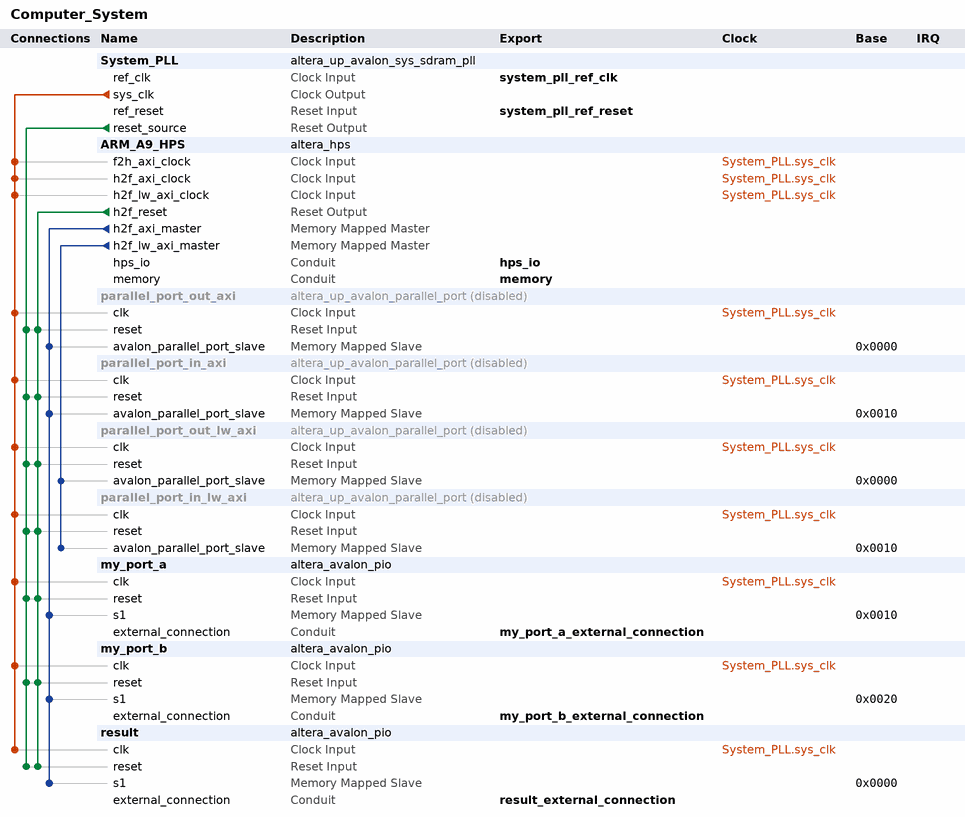
[diagram p0: system contents]
# Platform Designer (Qsys) system Computer_System, Cyclone V 5CSEMA5F31C6
# Parameters at their usual value, and those the tool derives, are not listed.
package require -exact qsys 18.0
create_system Computer_System
set_project_property DEVICE_FAMILY {Cyclone V}
set_project_property DEVICE 5CSEMA5F31C6

add_instance System_PLL altera_up_avalon_sys_sdram_pll 18.0
set_instance_parameter_value System_PLL CV_boards DE1-SoC
set_instance_parameter_value System_PLL gui_outclk 100.0
set_instance_parameter_value System_PLL gui_refclk 50.0

add_instance ARM_A9_HPS altera_hps 18.1
set_instance_parameter_value ARM_A9_HPS EMAC1_Mode RGMII
set_instance_parameter_value ARM_A9_HPS EMAC1_PinMuxing {HPS I/O Set 0}
set_instance_parameter_value ARM_A9_HPS F2SCLK_COLDRST_Enable false
set_instance_parameter_value ARM_A9_HPS F2SCLK_DBGRST_Enable false
set_instance_parameter_value ARM_A9_HPS F2SCLK_WARMRST_Enable false
set_instance_parameter_value ARM_A9_HPS F2SINTERRUPT_Enable true
set_instance_parameter_value ARM_A9_HPS F2S_Width 2
set_instance_parameter_value ARM_A9_HPS FPGA_PERIPHERAL_OUTPUT_CLOCK_FREQ_EMAC0_GTX_CLK 125
set_instance_parameter_value ARM_A9_HPS FPGA_PERIPHERAL_OUTPUT_CLOCK_FREQ_EMAC0_MD_CLK 100.0
set_instance_parameter_value ARM_A9_HPS FPGA_PERIPHERAL_OUTPUT_CLOCK_FREQ_EMAC1_GTX_CLK 125
set_instance_parameter_value ARM_A9_HPS FPGA_PERIPHERAL_OUTPUT_CLOCK_FREQ_EMAC1_MD_CLK 100.0
set_instance_parameter_value ARM_A9_HPS HPS_PROTOCOL DDR3
set_instance_parameter_value ARM_A9_HPS I2C0_Mode I2C
set_instance_parameter_value ARM_A9_HPS I2C0_PinMuxing {HPS I/O Set 0}
set_instance_parameter_value ARM_A9_HPS I2C1_Mode I2C
set_instance_parameter_value ARM_A9_HPS I2C1_PinMuxing {HPS I/O Set 0}
set_instance_parameter_value ARM_A9_HPS LWH2F_Enable true
set_instance_parameter_value ARM_A9_HPS MEM_BANKADDR_WIDTH 3
set_instance_parameter_value ARM_A9_HPS MEM_CLK_FREQ 400.0
set_instance_parameter_value ARM_A9_HPS MEM_COL_ADDR_WIDTH 10
set_instance_parameter_value ARM_A9_HPS MEM_DQ_WIDTH 32
set_instance_parameter_value ARM_A9_HPS MEM_DRV_STR RZQ/7
set_instance_parameter_value ARM_A9_HPS MEM_ROW_ADDR_WIDTH 15
set_instance_parameter_value ARM_A9_HPS MEM_RTT_NOM RZQ/4
set_instance_parameter_value ARM_A9_HPS MEM_RTT_WR RZQ/4
set_instance_parameter_value ARM_A9_HPS MEM_TCL 11
set_instance_parameter_value ARM_A9_HPS MEM_TFAW_NS 30.0
set_instance_parameter_value ARM_A9_HPS MEM_TRAS_NS 35.0
set_instance_parameter_value ARM_A9_HPS MEM_TRCD_NS 13.75
set_instance_parameter_value ARM_A9_HPS MEM_TRFC_NS 260.0
set_instance_parameter_value ARM_A9_HPS MEM_TRP_NS 13.75
set_instance_parameter_value ARM_A9_HPS MEM_VENDOR JEDEC
set_instance_parameter_value ARM_A9_HPS MEM_WTCL 8
set_instance_parameter_value ARM_A9_HPS QSPI_Mode {1 SS}
set_instance_parameter_value ARM_A9_HPS QSPI_PinMuxing {HPS I/O Set 0}
set_instance_parameter_value ARM_A9_HPS REF_CLK_FREQ 25.0
set_instance_parameter_value ARM_A9_HPS S2FCLK_USER2CLK 5
set_instance_parameter_value ARM_A9_HPS S2F_Width 3
set_instance_parameter_value ARM_A9_HPS SDIO_Mode {4-bit Data}
set_instance_parameter_value ARM_A9_HPS SDIO_PinMuxing {HPS I/O Set 0}
set_instance_parameter_value ARM_A9_HPS SPIM1_Mode {Single Slave Select}
set_instance_parameter_value ARM_A9_HPS SPIM1_PinMuxing {HPS I/O Set 0}
set_instance_parameter_value ARM_A9_HPS STM_Enable false
set_instance_parameter_value ARM_A9_HPS TIMING_BOARD_AC_SKEW 0.03
set_instance_parameter_value ARM_A9_HPS TIMING_BOARD_AC_TO_CK_SKEW 0.0
set_instance_parameter_value ARM_A9_HPS TIMING_BOARD_DQ_TO_DQS_SKEW 0.0
set_instance_parameter_value ARM_A9_HPS TIMING_BOARD_MAX_CK_DELAY 0.03
set_instance_parameter_value ARM_A9_HPS TIMING_BOARD_MAX_DQS_DELAY 0.02
set_instance_parameter_value ARM_A9_HPS TIMING_BOARD_SKEW_BETWEEN_DQS 0.08
set_instance_parameter_value ARM_A9_HPS TIMING_BOARD_SKEW_CKDQS_DIMM_MAX 0.16
set_instance_parameter_value ARM_A9_HPS TIMING_BOARD_SKEW_CKDQS_DIMM_MIN 0.09
set_instance_parameter_value ARM_A9_HPS TIMING_BOARD_SKEW_WITHIN_DQS 0.01
set_instance_parameter_value ARM_A9_HPS TIMING_TDH 65
set_instance_parameter_value ARM_A9_HPS TIMING_TDQSCK 255
set_instance_parameter_value ARM_A9_HPS TIMING_TDQSQ 125
set_instance_parameter_value ARM_A9_HPS TIMING_TDS 30
set_instance_parameter_value ARM_A9_HPS TIMING_TIH 140
set_instance_parameter_value ARM_A9_HPS TIMING_TIS 180
set_instance_parameter_value ARM_A9_HPS TIMING_TQSH 0.4
set_instance_parameter_value ARM_A9_HPS UART0_Mode {No Flow Control}
set_instance_parameter_value ARM_A9_HPS UART0_PinMuxing {HPS I/O Set 0}
set_instance_parameter_value ARM_A9_HPS USB1_Mode SDR
set_instance_parameter_value ARM_A9_HPS USB1_PinMuxing {HPS I/O Set 0}
set_instance_parameter_value ARM_A9_HPS desired_cfg_clk_mhz 100.0
set_instance_parameter_value ARM_A9_HPS desired_qspi_clk_mhz 400.0

add_instance parallel_port_out_axi altera_up_avalon_parallel_port 18.0
set_instance_property parallel_port_out_axi ENABLED false
set_instance_parameter_value parallel_port_out_axi board DE2-115
set_instance_parameter_value parallel_port_out_axi capture false
set_instance_parameter_value parallel_port_out_axi custom_port true
set_instance_parameter_value parallel_port_out_axi edge Rising
set_instance_parameter_value parallel_port_out_axi irq false
set_instance_parameter_value parallel_port_out_axi preset Pushbuttons

add_instance parallel_port_in_axi altera_up_avalon_parallel_port 18.0
set_instance_property parallel_port_in_axi ENABLED false
set_instance_parameter_value parallel_port_in_axi board DE2-115
set_instance_parameter_value parallel_port_in_axi capture false
set_instance_parameter_value parallel_port_in_axi custom_port true
set_instance_parameter_value parallel_port_in_axi edge Rising
set_instance_parameter_value parallel_port_in_axi irq false
set_instance_parameter_value parallel_port_in_axi preset Pushbuttons

add_instance parallel_port_out_lw_axi altera_up_avalon_parallel_port 18.0
set_instance_property parallel_port_out_lw_axi ENABLED false
set_instance_parameter_value parallel_port_out_lw_axi board DE2-115
set_instance_parameter_value parallel_port_out_lw_axi capture false
set_instance_parameter_value parallel_port_out_lw_axi custom_port true
set_instance_parameter_value parallel_port_out_lw_axi edge Rising
set_instance_parameter_value parallel_port_out_lw_axi irq false
set_instance_parameter_value parallel_port_out_lw_axi preset Pushbuttons

add_instance parallel_port_in_lw_axi altera_up_avalon_parallel_port 18.0
set_instance_property parallel_port_in_lw_axi ENABLED false
set_instance_parameter_value parallel_port_in_lw_axi board DE2-115
set_instance_parameter_value parallel_port_in_lw_axi capture false
set_instance_parameter_value parallel_port_in_lw_axi custom_port true
set_instance_parameter_value parallel_port_in_lw_axi edge Rising
set_instance_parameter_value parallel_port_in_lw_axi irq false
set_instance_parameter_value parallel_port_in_lw_axi preset Pushbuttons

add_instance my_port_a altera_avalon_pio 18.1
set_instance_parameter_value my_port_a direction Output
set_instance_parameter_value my_port_a width 8

add_instance my_port_b altera_avalon_pio 18.1
set_instance_parameter_value my_port_b direction Output
set_instance_parameter_value my_port_b width 8

add_instance result altera_avalon_pio 18.1
set_instance_parameter_value result direction Input
set_instance_parameter_value result width 8

# connections
add_connection System_PLL.sys_clk ARM_A9_HPS.f2h_axi_clock clock
add_connection System_PLL.sys_clk ARM_A9_HPS.h2f_axi_clock clock
add_connection System_PLL.sys_clk ARM_A9_HPS.h2f_lw_axi_clock clock
add_connection System_PLL.sys_clk my_port_a.clk clock
add_connection System_PLL.sys_clk my_port_b.clk clock
add_connection System_PLL.sys_clk parallel_port_in_axi.clk clock
add_connection System_PLL.sys_clk parallel_port_in_lw_axi.clk clock
add_connection System_PLL.sys_clk parallel_port_out_axi.clk clock
add_connection System_PLL.sys_clk parallel_port_out_lw_axi.clk clock
add_connection System_PLL.sys_clk result.clk clock
add_connection ARM_A9_HPS.h2f_reset my_port_a.reset reset
add_connection ARM_A9_HPS.h2f_reset my_port_b.reset reset
add_connection ARM_A9_HPS.h2f_reset parallel_port_in_axi.reset reset
add_connection ARM_A9_HPS.h2f_reset parallel_port_in_lw_axi.reset reset
add_connection ARM_A9_HPS.h2f_reset parallel_port_out_axi.reset reset
add_connection ARM_A9_HPS.h2f_reset parallel_port_out_lw_axi.reset reset
add_connection ARM_A9_HPS.h2f_reset result.reset reset
add_connection System_PLL.reset_source my_port_a.reset reset
add_connection System_PLL.reset_source my_port_b.reset reset
add_connection System_PLL.reset_source parallel_port_in_axi.reset reset
add_connection System_PLL.reset_source parallel_port_in_lw_axi.reset reset
add_connection System_PLL.reset_source parallel_port_out_axi.reset reset
add_connection System_PLL.reset_source parallel_port_out_lw_axi.reset reset
add_connection System_PLL.reset_source result.reset reset
add_connection ARM_A9_HPS.h2f_axi_master my_port_a.s1 avalon
set_connection_parameter_value ARM_A9_HPS.h2f_axi_master/my_port_a.s1 baseAddress 0x0010
add_connection ARM_A9_HPS.h2f_axi_master my_port_b.s1 avalon
set_connection_parameter_value ARM_A9_HPS.h2f_axi_master/my_port_b.s1 baseAddress 0x0020
add_connection ARM_A9_HPS.h2f_axi_master parallel_port_in_axi.avalon_parallel_port_slave avalon
set_connection_parameter_value ARM_A9_HPS.h2f_axi_master/parallel_port_in_axi.avalon_parallel_port_slave baseAddress 0x0010
add_connection ARM_A9_HPS.h2f_axi_master parallel_port_out_axi.avalon_parallel_port_slave avalon
set_connection_parameter_value ARM_A9_HPS.h2f_axi_master/parallel_port_out_axi.avalon_parallel_port_slave baseAddress 0x0000
add_connection ARM_A9_HPS.h2f_axi_master result.s1 avalon
set_connection_parameter_value ARM_A9_HPS.h2f_axi_master/result.s1 baseAddress 0x0000
add_connection ARM_A9_HPS.h2f_lw_axi_master parallel_port_in_lw_axi.avalon_parallel_port_slave avalon
set_connection_parameter_value ARM_A9_HPS.h2f_lw_axi_master/parallel_port_in_lw_axi.avalon_parallel_port_slave baseAddress 0x0010
add_connection ARM_A9_HPS.h2f_lw_axi_master parallel_port_out_lw_axi.avalon_parallel_port_slave avalon
set_connection_parameter_value ARM_A9_HPS.h2f_lw_axi_master/parallel_port_out_lw_axi.avalon_parallel_port_slave baseAddress 0x0000

# exported interfaces
add_interface hps_io conduit end
set_interface_property hps_io EXPORT_OF ARM_A9_HPS.hps_io
add_interface memory conduit end
set_interface_property memory EXPORT_OF ARM_A9_HPS.memory
add_interface my_port_a_external_connection conduit end
set_interface_property my_port_a_external_connection EXPORT_OF my_port_a.external_connection
add_interface my_port_b_external_connection conduit end
set_interface_property my_port_b_external_connection EXPORT_OF my_port_b.external_connection
add_interface result_external_connection conduit end
set_interface_property result_external_connection EXPORT_OF result.external_connection
add_interface system_pll_ref_clk clock sink
set_interface_property system_pll_ref_clk EXPORT_OF System_PLL.ref_clk
add_interface system_pll_ref_reset reset sink
set_interface_property system_pll_ref_reset EXPORT_OF System_PLL.ref_reset

set_interconnect_requirement {$system} qsys_mm.clockCrossingAdapter HANDSHAKE
set_interconnect_requirement {$system} qsys_mm.enableEccProtection FALSE
set_interconnect_requirement {$system} qsys_mm.insertDefaultSlave FALSE
set_interconnect_requirement {$system} qsys_mm.maxAdditionalLatency 1

save_system Computer_System.qsys
